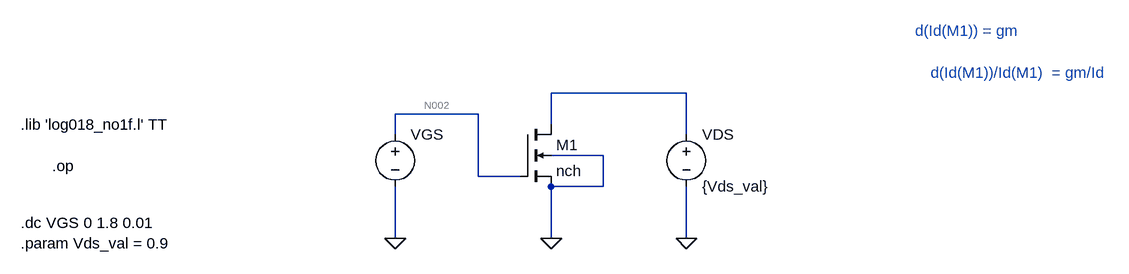
[diagram p0: schematic gmID.asc]
gmID.asc, the LTspice schematic file:
Version 4
SHEET 1 1664 680
WIRE 960 -64 752 -64
WIRE 640 -32 512 -32
WIRE 752 -16 752 -64
WIRE 512 0 512 -32
WIRE 960 0 960 -64
WIRE 832 32 752 32
WIRE 640 64 640 -32
WIRE 704 64 640 64
WIRE 832 80 832 32
WIRE 832 80 752 80
WIRE 512 160 512 80
WIRE 752 160 752 80
WIRE 960 160 960 80
FLAG 752 160 0
FLAG 512 160 0
FLAG 960 160 0
SYMBOL nmos4 704 -16 R0
SYMATTR InstName M1
SYMATTR Value nch
SYMATTR Value2 l=0.36u w=10u
SYMBOL voltage 960 -16 R0
WINDOW 123 0 0 Left 0
WINDOW 39 0 0 Left 0
SYMATTR InstName VDS
SYMATTR Value {Vds_val}
SYMBOL voltage 512 -16 R0
WINDOW 123 0 0 Left 0
WINDOW 39 0 0 Left 0
SYMATTR InstName VGS
SYMATTR Value ""
TEXT -64 -16 Left 2 !.lib 'log018_no1f.l' TT
TEXT -64 136 Left 2 !.dc VGS 0 1.8 0.01\n.param Vds_val = 0.9
TEXT -16 48 Left 2 !.op
TEXT 1312 -160 Left 2 ;d(Id(M1)) = gm
TEXT 1336 -96 Left 2 ;d(Id(M1))/Id(M1)  = gm/Id

The netlist it stands for:
* gmID.asc
M1 N001 N002 0 0 nch l=0.36u w=10u
VDS N001 0 {Vds_val}
VGS N002 0
.model NMOS NMOS
.model PMOS PMOS
.lib standard.mos
.lib 'log018_no1f.l' TT
.dc VGS 0 1.8 0.01
.param Vds_val = 0.9
.op
* d(Id(M1)) = gm
* d(Id(M1))/Id(M1)  = gm/Id
.backanno
.end

* Results of the author's LTspice run, read from the files saved beside the schematic
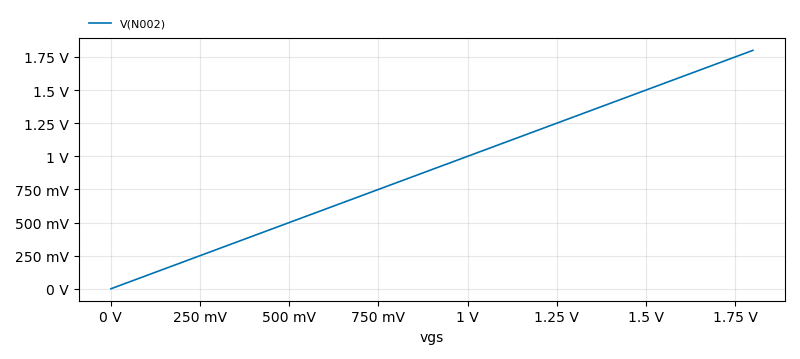
[diagram p1: DC transfer characteristic of gmID.asc, plotted from the saved traces]
* DC transfer characteristic, 1 run:
*   V(N002): 0 V at vgs=0 V, 1.8 V at vgs=1.8 V, min 0 V, max 1.8 V